# EAGLE design pa97 (EAGLE 7.2.0)
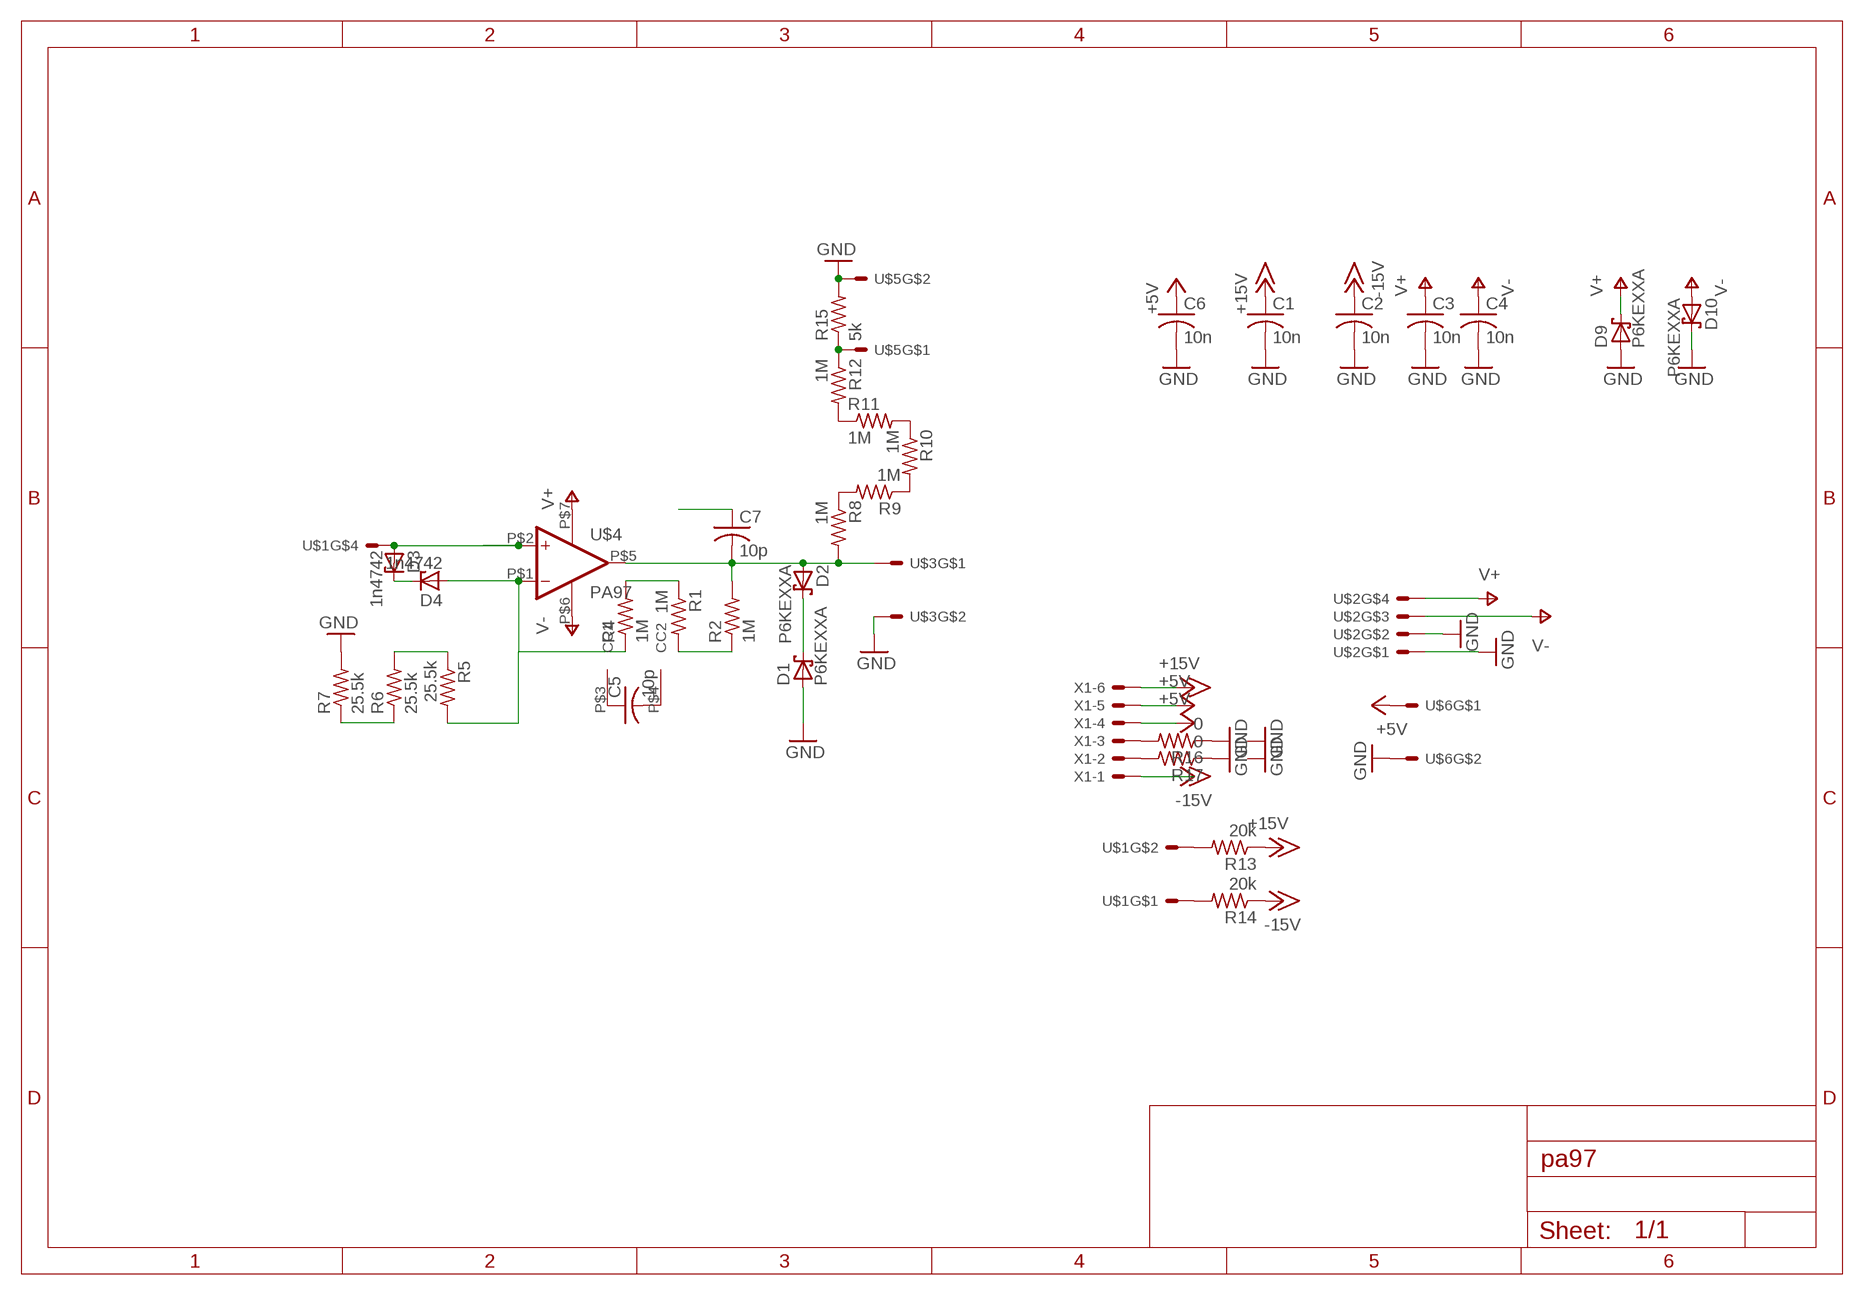
[diagram p0: schematic, sheet 1]

## Parts
C1  10n  C-US075-032X103  [C075-032X103]
C2  10n  C-US075-032X103  [C075-032X103]
C3  10n  C-US075-032X103  [C075-032X103]
C4  10n  C-US075-032X103  [C075-032X103]
C5  10p  C-US075-032X103  [C075-032X103]
C6  10n  C-US075-032X103  [C075-032X103]
C7  10p  C-US075-032X103  [C075-032X103]
D1  P6KEXXA  [C1702-15]
D2  P6KEXXA  [C1702-15]
D3  1n4742  ZENER-DIODEDO41Z10  [DO41Z10]
D4  1n4742  ZENER-DIODEDO41Z10  [DO41Z10]
D9  P6KEXXA  [C1702-15]
D10  P6KEXXA  [C1702-15]
R1  1M  R-US_0207/10  [0207/10]
R2  1M  R-US_0207/10  [0207/10]
R4  1M  R-US_0207/10  [0207/10]
R5  25.5k  R-US_0207/10  [0207/10]
R6  25.5k  R-US_0207/10  [0207/10]
R7  25.5k  R-US_0207/10  [0207/10]
R8  1M  R-US_0207/10  [0207/10]
R9  1M  R-US_0207/10  [0207/10]
R10  1M  R-US_0207/10  [0207/10]
R11  1M  R-US_0207/10  [0207/10]
R12  1M  R-US_0207/10  [0207/10]
R13  20k  R-US_0207/10  [0207/10]
R14  20k  R-US_0207/10  [0207/10]
R15  5k  R-US_0207/10  [0207/10]
R16  0  R-US_0207/10  [0207/10]
R17  0  R-US_0207/10  [0207/10]
U$1  5569-4  [5669-4]
U$2  5569-4  [5669-4]
U$3  5569-2  [5569-2]
U$4  PA97  [7SIP]
U$5  5569-2  [5569-2]
U$6  5569-2  [5569-2]
X1  KK-156-6  [KK-156-6]

## Nets
+5V: C6.1 U$6.P$1 X1.4 X1.5
+15V: C1.1 R13.1 X1.6
-15V: C2.1 R14.1 X1.1
GND: C1.2 C2.2 C3.2 C4.2 C6.2 D1.A D9.A D10.C R7.2 R15.2 R16.1 R17.1 U$2.P$1 U$2.P$2 U$3.P$2 U$5.P$2 U$6.P$2
N$1: D1.C D2.C
N$2: R1.1 R4.2
N$3: D4.A R4.1 R5.2 U$4.P$1(-IN)
N$4: R5.1 R6.2
N$5: R6.1 R7.1
N$6: C5.1 U$4.P$3(CC1)
N$7: C5.2 U$4.P$4(CC2)
N$8: R1.2 R2.1
N$9: R13.2 U$1.P$2
N$10: C7.1
N$11: C7.2 D2.A R2.2 R8.2 U$3.P$1 U$4.P$5(OUT)
N$12: R8.1 R9.2
N$13: D3.A U$1.P$4 U$4.P$2(+IN)
N$14: R9.1 R10.2
N$15: R10.1 R11.2
N$16: R11.1 R12.2
N$17: R12.1 R15.1 U$5.P$1
N$18: R16.2 X1.3
N$19: R17.2 X1.2
N$20: D3.C D4.C
N$24: R14.2 U$1.P$1
V+: C3.1 D9.C U$2.P$4 U$4.P$7(V+)
V-: C4.1 D10.A U$2.P$3 U$4.P$6(V-)
Unconnected: U$1.P$3

## Library data of the parts
C1-C7 = rcl:C-US: CAPACITOR, American symbol
D1 D2 D9 D10 = diode:P6KEXXA: DIODE transient-voltage suppressor
D3 D4 = diode:ZENER-DIODE: Z-Diode
R1 R2 R4-R17 = rcl:R-US_: RESISTOR, American symbol
U$1 U$2 = con-molex:5569-4
U$3 U$5 U$6 = con-molex:5569-2
U$4 = apex:PA97
X1 = con-molex:KK-156-6: KK 156 HEADER Source: http://www.molex.com/pdm_docs/sd/026604100_sd.pdf; OC_FARNELL: unknown; OC_NEWARK: unknown

## Board
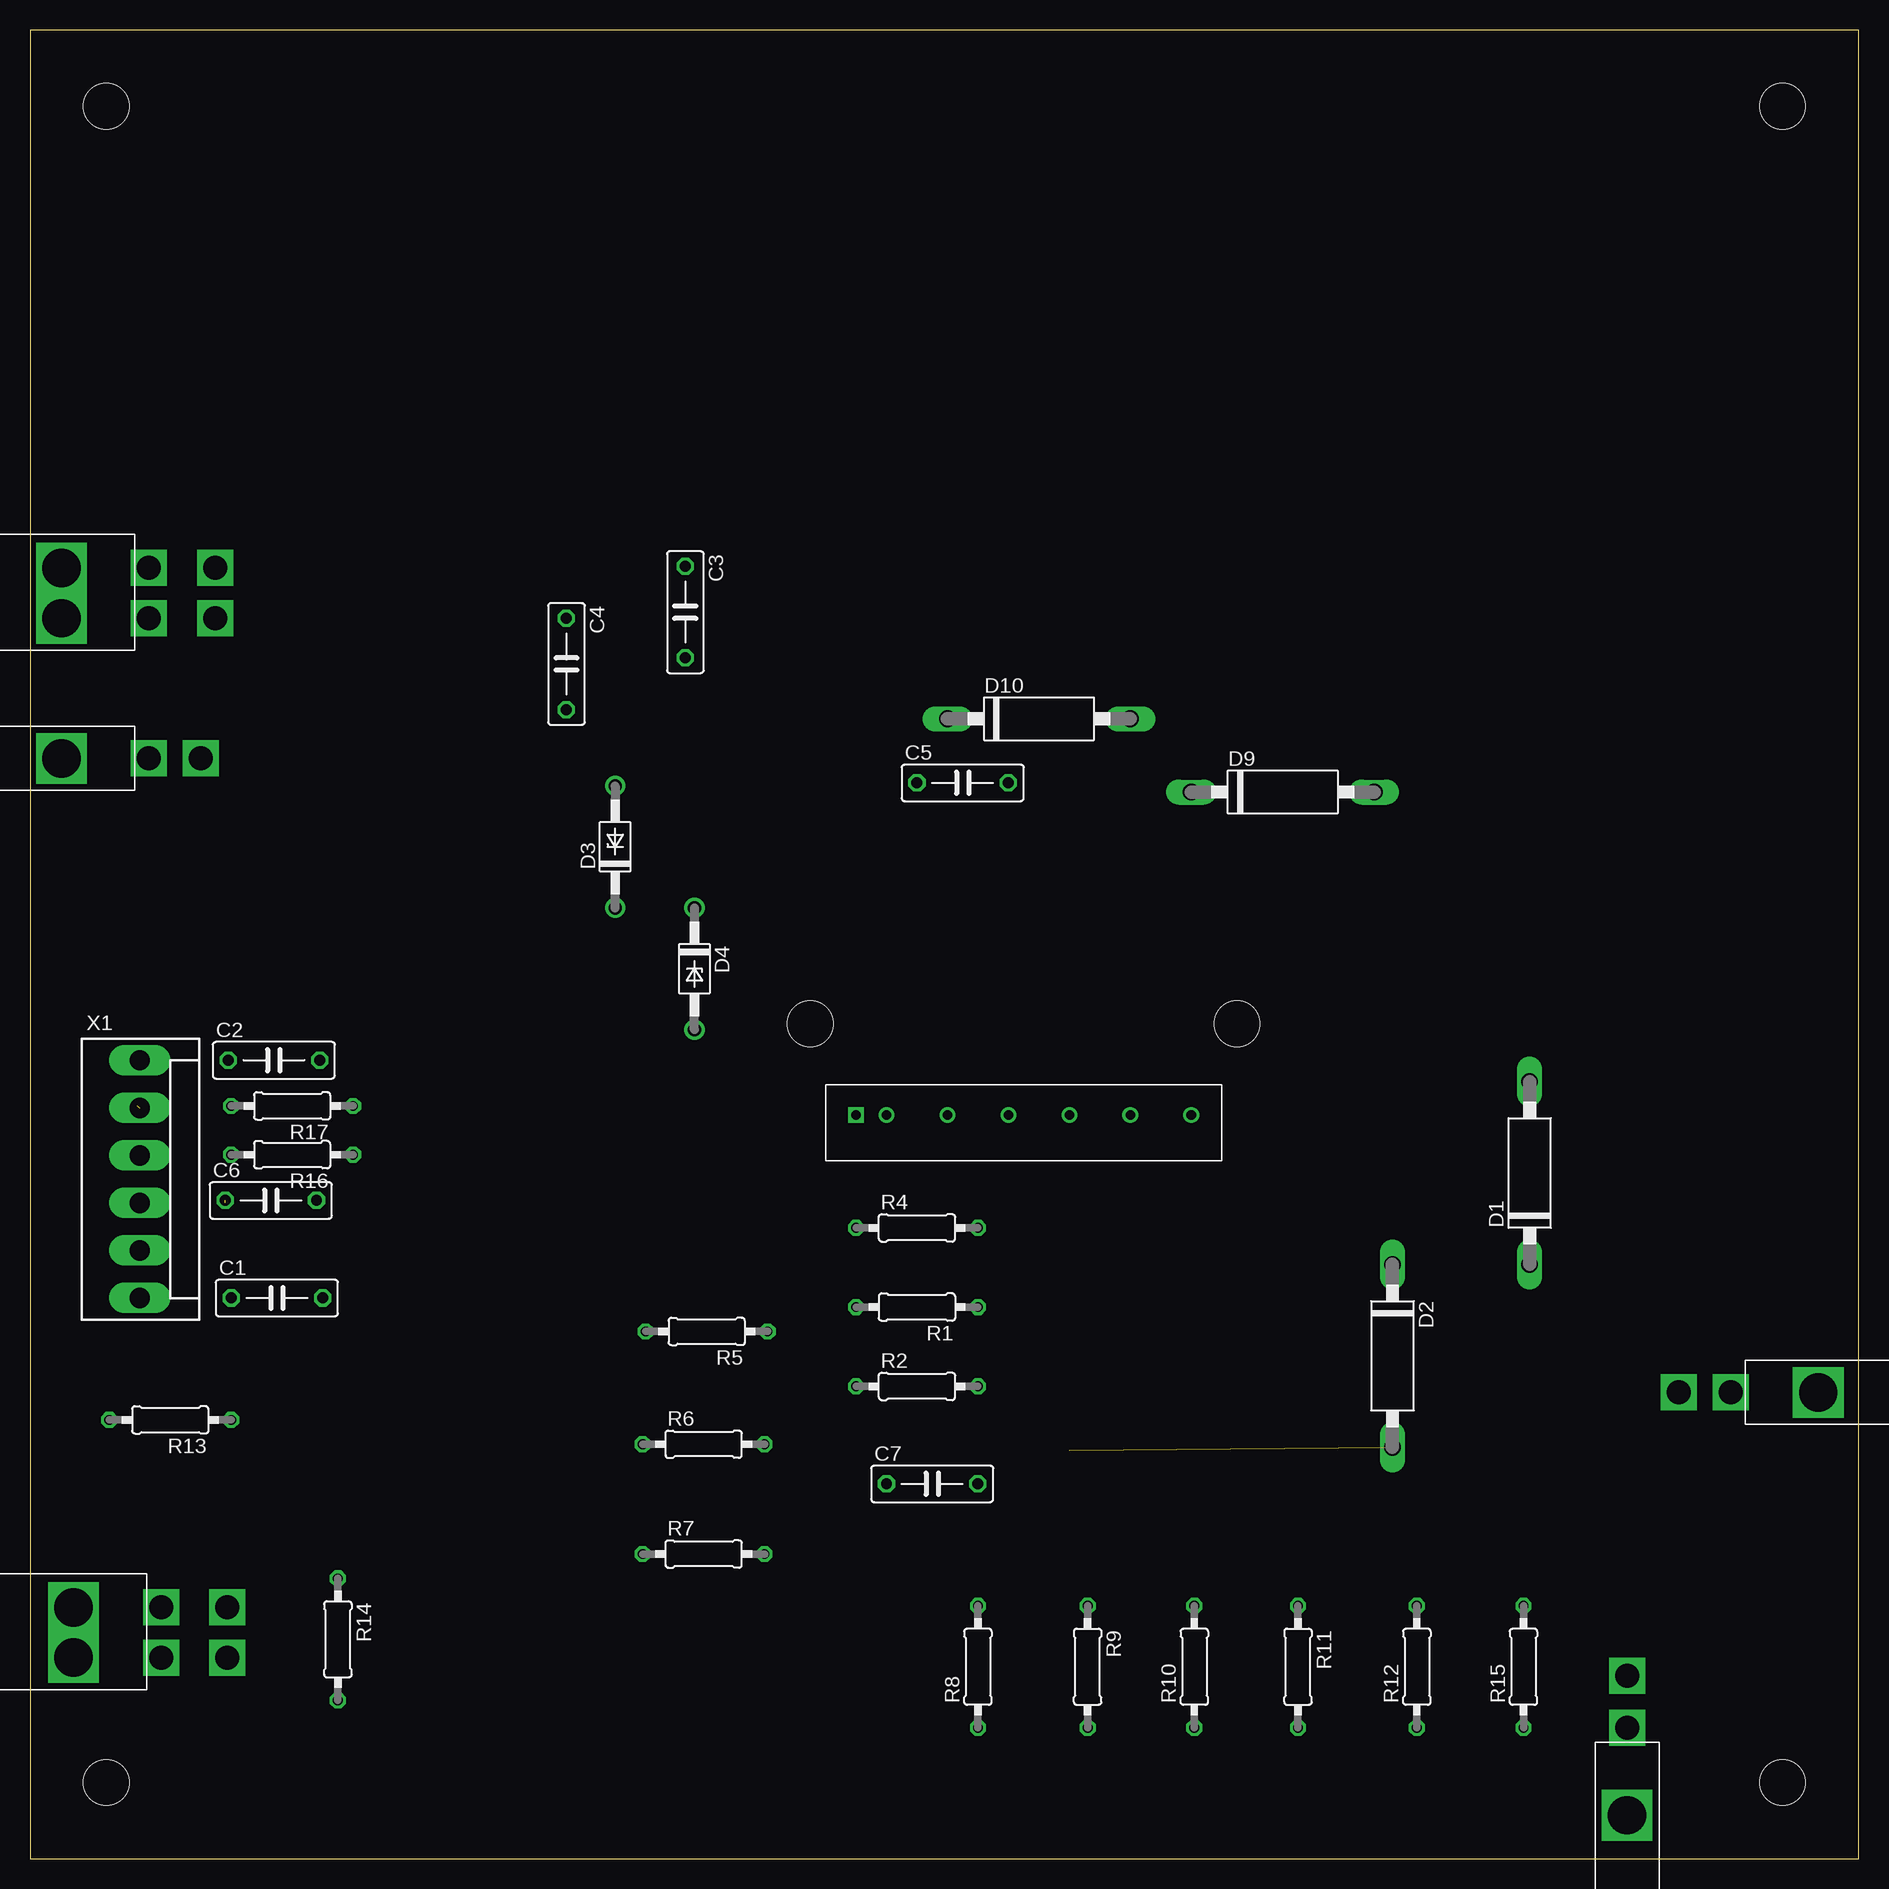
[diagram p1: board, top side]
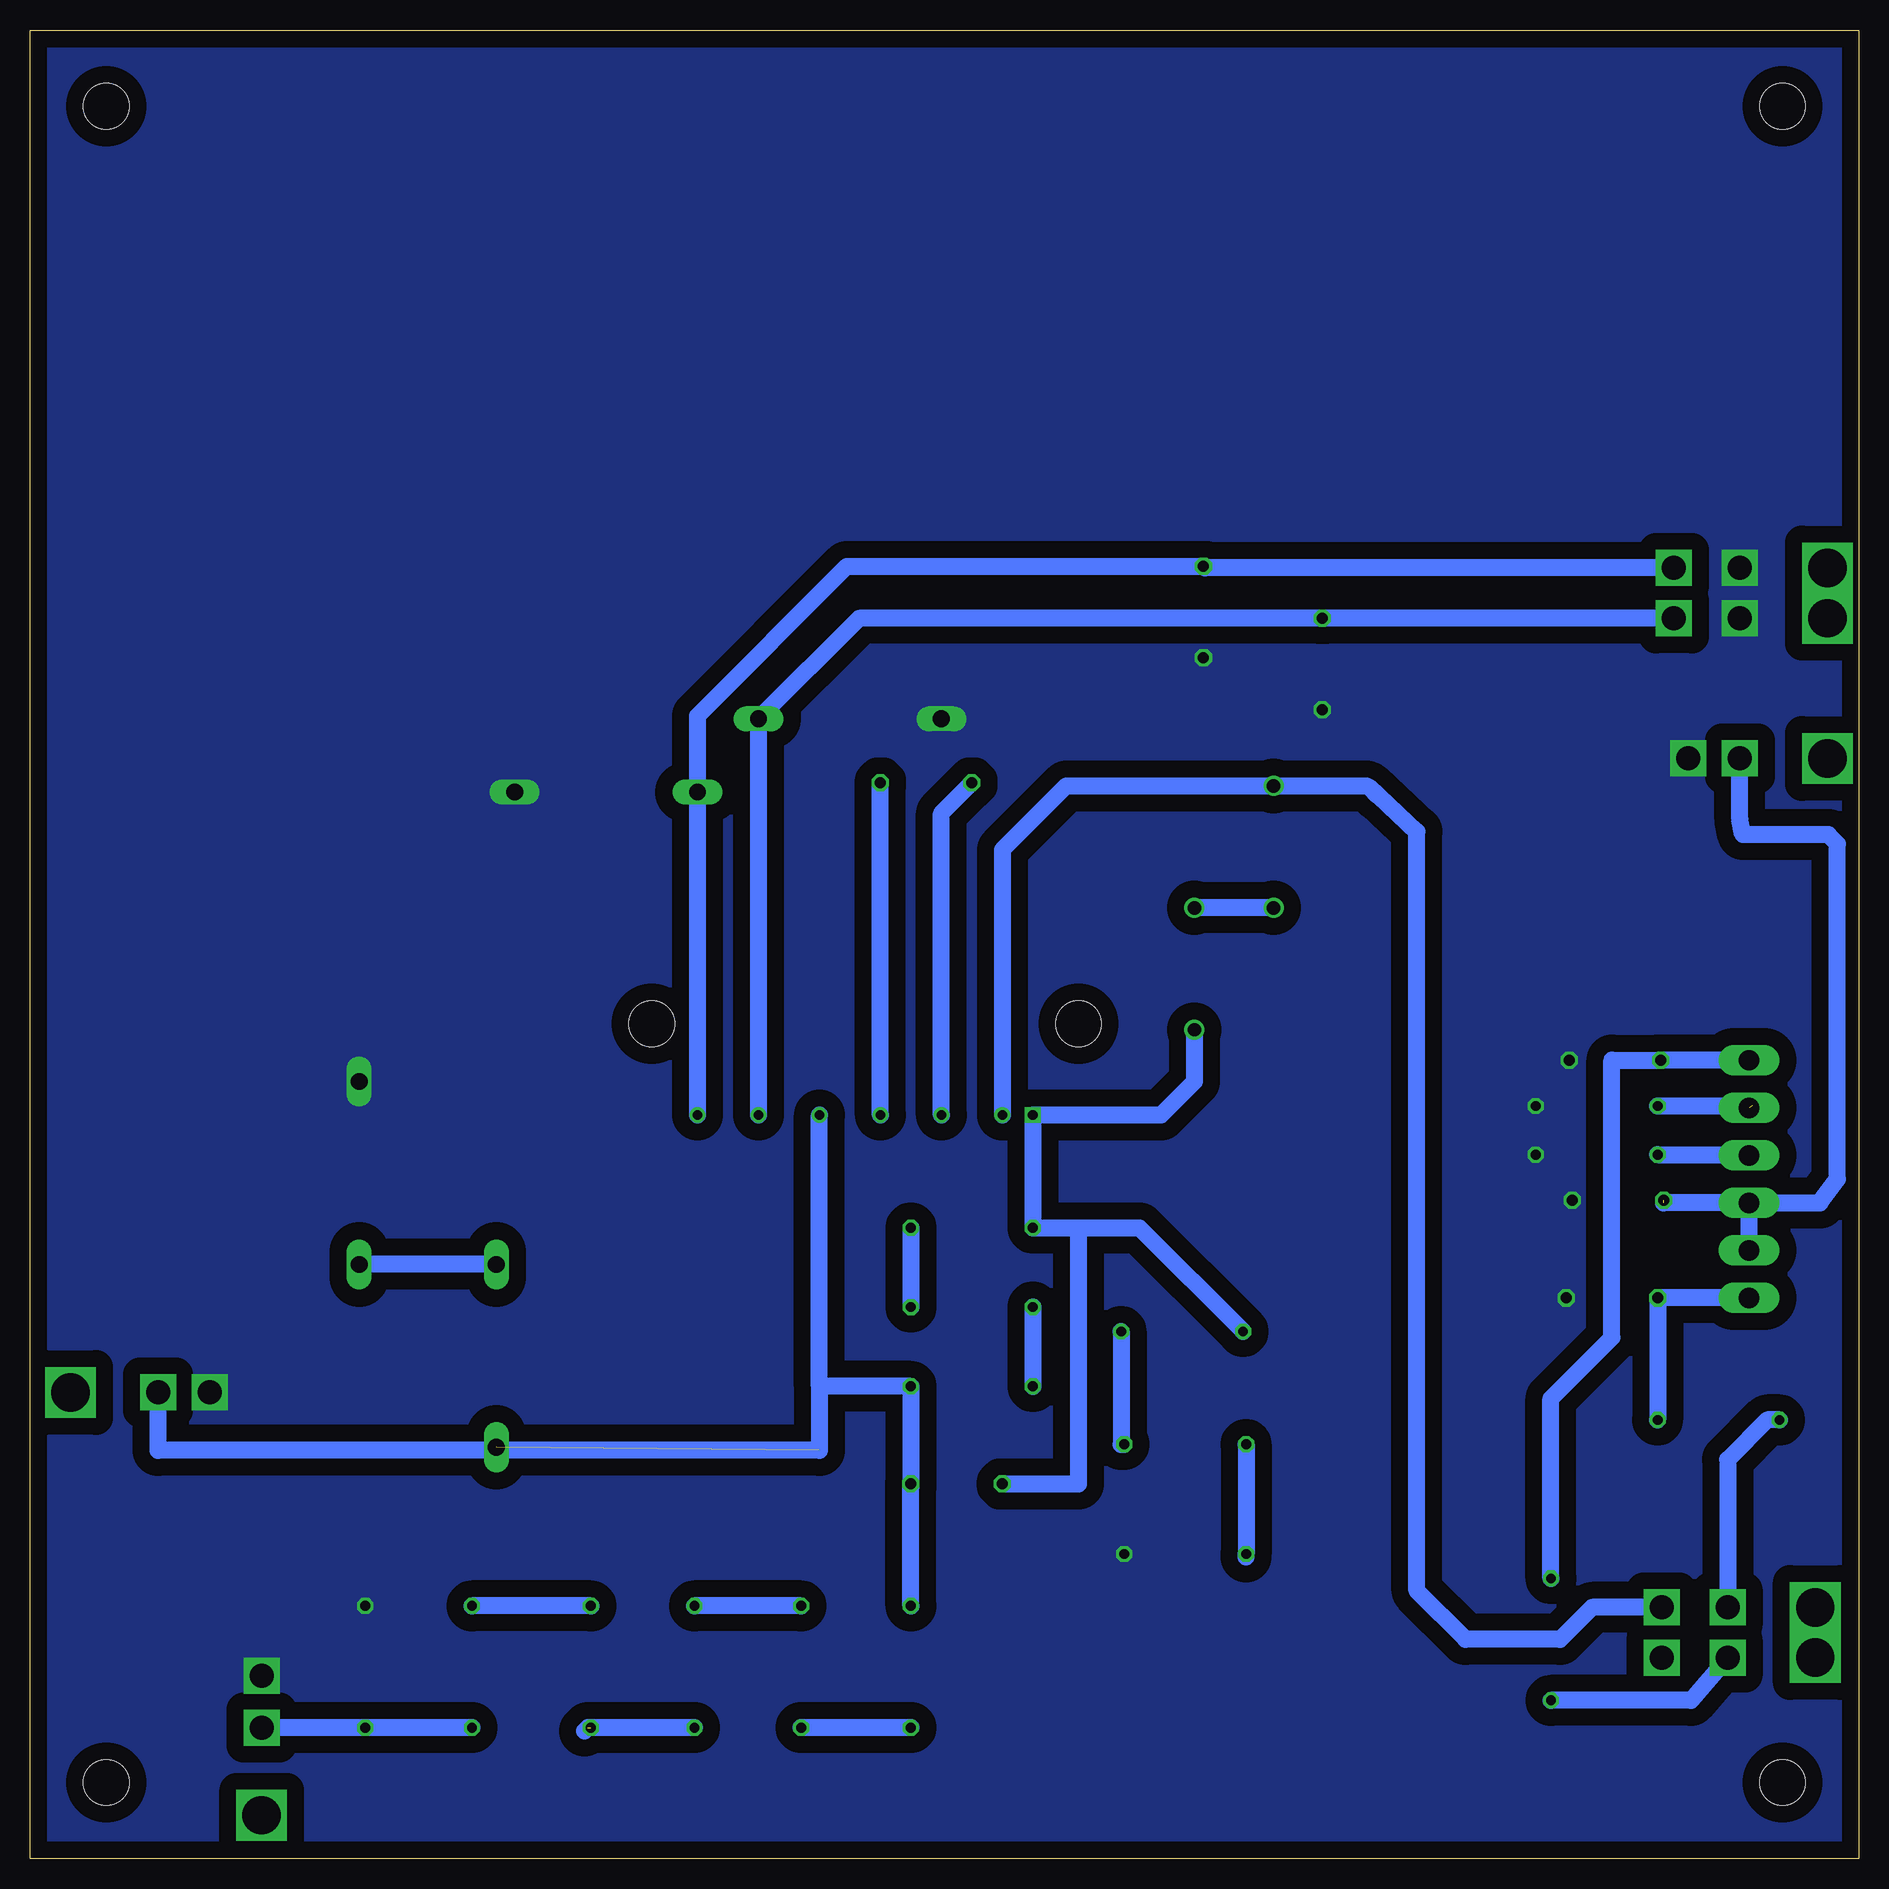
[diagram p2: board, bottom side, seen from below]

Size 152.4 x 152.4 mm. Coordinates in mm from the lower left corner, seen from the top.
Outline: 0,0 152.4,0 152.4,152.4 0,152.4 0,0
Copper layers (1*16): Top 0.035mm / dielectric 1.5mm / Bottom 0.035mm
Design rules "default": minimum track width 10mil, minimum drill 24mil, track to track 8mil, track to pad 8mil, pad to pad 8mil, via to via 8mil, smd to smd 8mil, copper to edge 40mil, drill to drill 8mil, minimum pad ring 10mil, minimum via ring 8mil, stop-mask expansion 4mil, vias tented up to drill 0mil, thermal gap 10mil
Holes 3.8 mm at 6.35,146.05 146.05,6.35 146.05,146.05 6.35,6.35 65.02,69.6 100.58,69.6

### Footprints (pad centres in the part's own frame; a part is rotated, then mirrored left to right if it is on the bottom)
C075-032X103 = drill 0.914 octagon: 1 -3.81,0; 2 3.81,0
C1702-15 = drill 1.397 long: A 7.62,0; C -7.62,0
DO41Z10 = drill 1.118: A 5.08,0; C -5.08,0
0207/10 = drill 0.813 octagon: 1 -5.08,0; 2 5.08,0
5669-4 = drill 2 square: P$1 0,0; P$2 -4.191,0; P$3 0,5.512; P$4 -4.191,5.512 | drill 3.2 square: P$5 0,-7.29; P$6 -4.191,-7.29
5569-2 = drill 2 square: P$1 0,0; P$2 0,4.318 | drill 3.2 square: P$4 0,-7.29
7SIP = drill 0.8 square: P$1 0,0 | drill 0.8: P$2 2.54,0; P$3 7.62,0; P$4 12.7,0; P$5 17.78,0; P$6 22.86,0; P$7 27.94,0
KK-156-6 = drill 1.7 pad 2.184 long: 1 -9.9,0; 2 -5.94,0; 3 -1.98,0; 4 1.98,0; 5 5.94,0; 6 9.9,0

### Placement (x,y rotation side)
C1  20.57,46.74 0 top
C2  20.32,66.55 0 top
C3  54.61,103.89 270 top
C4  44.7,99.57 270 top
C5  77.72,89.66 0 top
C6  20.07,54.86 0 top
C7  75.18,31.24 0 top
D1  124.97,57.15 90 top
D2  113.54,41.91 270 top
D3  48.77,84.33 90 top
D4  55.37,74.17 270 top
D9  104.39,88.9 0 top
D10  84.07,95 0 top
R1  73.91,45.97 180 top
R2  73.91,39.37 0 top
R4  73.91,52.58 0 top
R5  56.39,43.94 180 top
R6  56.13,34.54 0 top
R7  56.13,25.4 0 top
R8  78.99,16 90 top
R9  88.14,16 270 top
R10  97.03,16 90 top
R11  105.66,16 270 top
R12  115.57,16 90 top
R13  11.68,36.58 180 top
R14  25.65,18.29 270 top
R15  124.46,16 90 top
R16  21.84,58.67 180 top
R17  21.84,62.74 180 top
U$1  10.92,16.76 270 top
U$2  9.91,103.38 270 top
U$3  141.73,38.86 90 top
U$4  68.83,61.98 0 top
U$5  133.1,10.92 0 top
U$6  9.91,91.69 270 top
X1  9.14,56.64 270 top

### Tracks (layer width: path | path; a pad name or v marks a point on that pad's centre or on a via)
+5V  (1 unrouted)
  Bottom 1.422: X1.4 16.26,54.66 | X1.4 3.25,54.66 1.78,56.64 1.78,84.58 2.54,85.34 9.65,85.34 9.91,86.61 U$6.P$1 | X1.5 X1.4
+15V
  Bottom 1.422: X1.6 C1.1 R13.1
-15V
  Bottom 1.422: X1.1 C2.1 20.57,66.55 20.57,43.43 25.65,38.35 R14.1
GND
  pour Bottom (isolate 1.422, no thermals): 0,0 152.4,0 152.4,152.4 0,152.4
N$1
  Bottom 1.422: D2.C D1.C
N$2
  Bottom 1.422: R4.2 R1.1
N$3
  Bottom 1.422: D4.A 55.37,64.77 58.17,61.98 U$4.P$1 R4.1 59.94,52.58 R5.2
N$4
  Bottom 1.422: R5.1 61.47,34.54 R6.2
N$5
  Bottom 1.422: R6.1 R7.1 51.05,25.15
N$6
  Bottom 1.422: U$4.P$3 76.45,87.12 C5.1
N$7
  Bottom 1.422: U$4.P$4 C5.2
N$8
  Bottom 1.422: R1.2 R2.1
N$9
  Bottom 1.422: R13.2 7.62,36.58 10.92,33.27 U$1.P$2
N$10
  Bottom 1.422: C7.1 65.02,31.24 65.02,52.58
N$11  (1 unrouted)
  Bottom 1.422: 86.61,39.37 R2.2 C7.2 | 86.61,39.37 U$4.P$5 | C7.2 78.99,30.99 | 86.61,39.37 86.61,34.04 141.73,34.04 U$3.P$1 | R8.2 C7.2
N$12
  Bottom 1.422: R8.1 R9.2
N$13
  Bottom 1.422: U$1.P$4 22.23,20.95 24.89,18.29 32.77,18.29 36.83,22.35 36.83,85.6 40.77,89.28 | U$4.P$2 71.37,84.07 66.04,89.41 D3.A 41.02,89.41 40.77,89.28 | 40.77,89.28 40.13,88.65
N$14
  Bottom 1.422: R9.1 R10.2
N$15  (1 unrouted)
  Bottom 1.422: R10.1 105.92,10.92 106.17,10.67
N$16
  Bottom 1.422: R11.1 R12.2
N$17
  Bottom 1.422: R12.1 R15.1 U$5.P$1
N$18
  Bottom 1.422: R16.2 9.2,58.67 X1.3
N$19  (1 unrouted)
  Bottom 1.422: R17.2 8.89,62.74 8.64,62.48
N$20
  Bottom 1.422: D3.C D4.C
N$24
  Bottom 1.422: U$1.P$1 13.97,13.21 R14.2
V+
  Bottom 1.422: U$4.P$7 D9.C | D9.C 96.52,89.41 | U$2.P$4 54.48,107.57 C3.1 84.33,107.7 96.77,95.25 D9.C
V-
  Bottom 1.422: U$4.P$6 D10.A 83.31,103.38 C4.1 U$2.P$3